# Altium schematic sheet Принципиальная схема 436122_001.SchDoc
size 209 x 297 mm; CompanyName: MOSTЫ; SheetNumber: 1; SheetTotal: 1; PageSetup: Record=PageOptions|CenterHorizontal=True|CenterVertical=True|PrintScale=0.94|XCorrection=1.00|YCorrection=1.00|PrintKind=1|BorderSize=5000000|LeftOffset=0|BottomOffset=0|Orientation=1|PaperLength=1000|PaperWidth=1000|Scale=100|PaperSource=7|PrintQuality=-4|MediaType=1|DitherType=10|PaperKind=A4|PrintScaleMode=1; DecimalNumber: XXXX.426122.001; Name1: Плата распределния; lit_A: О; Name2: питания
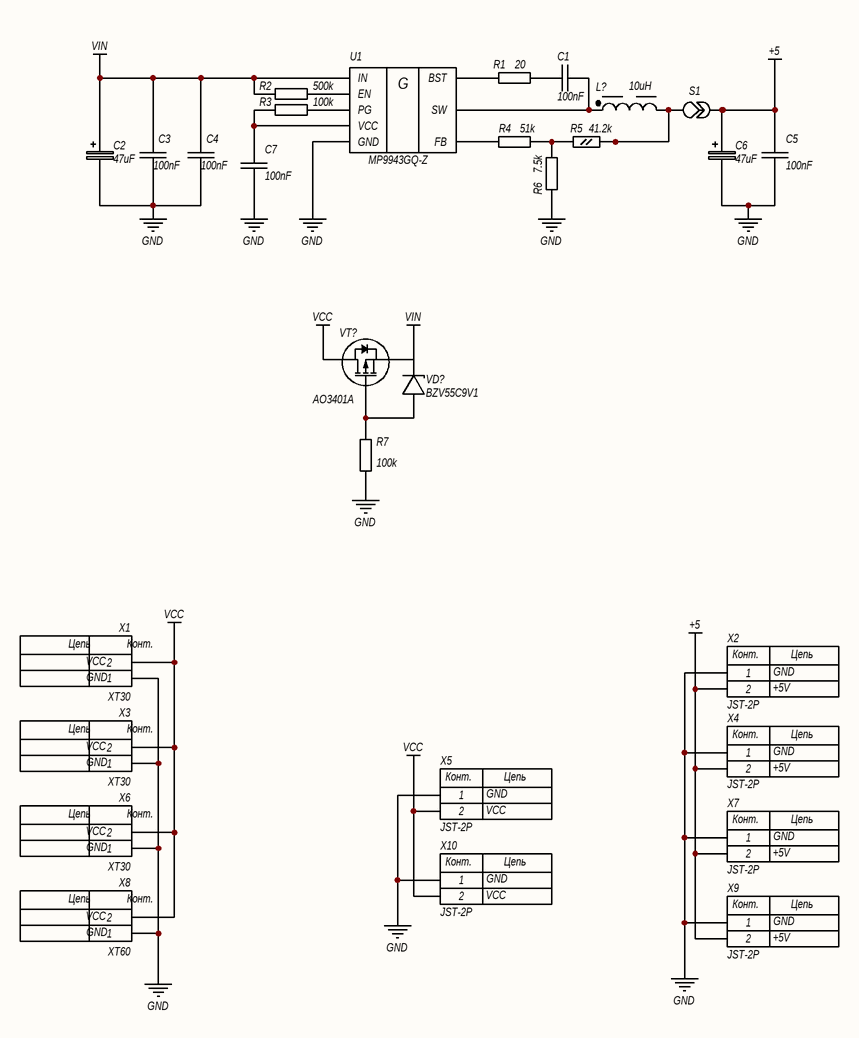
[diagram p0: Принципиальная схема 436122_001.SchDoc]

## Parts
C1  100nF  [CAPC2012X10N]
C2  47uF  [FP-TPSD-MFG]
C3  100nF  [CAPC2012X10N]
C4  100nF  [CAPC2012X10N]
C5  100nF  [CAPC2012X10N]
C6  47uF  [FP-TPSD-MFG]
C7  100nF  [CAPC2012X10N]
L?  10uH  [WE-TPC_4828]
R1  20  [RES0805]
R2  500k  [RES0805]
R3  100k  [RES0805]
R4  51k  [RES0805]
R5  41.2k  [МЛТ-0.125]
R6  7.5k  [RES0805]
R7  100k  [RES0805]
S1  (no value)  [Solder bridge]
U1  MP9943GQ-Z  [MP9943 QFN8]
VD?  BZV55C9V1  [FP-DO-213AA-MFG]
VT?  AO3401A  [SOT-23]
X1  XT30  [XT30PWM]
X2  JST-2P  [FP-B2B-XH-AM_LF_SN-MFG]
X3  XT30  [XT30PWM]
X4  JST-2P  [FP-S2B-XH-A-1_LF_SN-MFG]
X5  JST-2P  [FP-S2B-XH-A-1_LF_SN-MFG]
X6  XT30  [XT30PWM]
X7  JST-2P  [FP-S2B-XH-A-1_LF_SN-MFG]
X8  XT60  [XT60-perpendicular]
X9  JST-2P  [FP-S2B-XH-A-1_LF_SN-MFG]
X10  JST-2P  [FP-S2B-XH-A-1_LF_SN-MFG]

## Nets
+5: C5.1(+) C6.2(-) S1.2 X2.2 X4.2 X7.2 X9.2
GND: C2.1(+) C3.2(-) C4.2(-) C5.2(-) C6.1(+) C7.2(-) R6.1 R7.1 U1.5(GND) X1.1 X2.1 X3.1 X4.1 X5.1 X6.1 X7.1 X8.1 X9.1 X10.1
VCC: VT?.3(DRAIN) X1.2 X3.2 X5.2 X6.2 X8.2 X10.2
VIN: C2.2(-) C3.1(+) C4.1(+) R2.1 U1.7(IN) VD?.1 VT?.2(SOURCE)
NetC1_1: C1.1(+) L?.1 U1.6(SW)
NetC1_2: C1.2(-) R1.2
NetC7_1: C7.1(+) R3.1 U1.2(VCC)
NetL?_2: L?.2 R5.2 S1.1
NetR1_1: R1.1 U1.4(BST)
NetR2_2: R2.2 U1.3(EN)
NetR3_2: R3.2 U1.8(PG)
NetR4_1: R4.1 U1.1(FB)
NetR4_2: R4.2 R5.1 R6.2
NetR7_2: R7.2 VD?.2 VT?.1(GATE)

## Notes on the sheet
- Перв.примен.
- Справ.№
- Подп. и дата
- Инв.№ дубл.
- Взам.инв.№
- Подп.и дата
- Разраб.
- Изм.
- Лист
- № докум.
- Подп.
- Дата
- Лит.
- Масштаб
- Масса
- Т.контр.
- Пров.
- СХЕМА   ЭЛЕКТРИЧЕСКАЯ
- ПРИНЦИПИАЛЬНАЯ
- Листов
- Инв.№ подл.
- Утв.
- Н.контр.
- Нач.сект.
- (in symbol JST-2P) Конт.; Цепь
- (in symbol MP9943GQ-Z) G
- (in symbol XT30) Цепь; Конт.; VCC
- (in symbol XT60) Цепь; Конт.; VCC

## Library data of the parts
C1 C3-C5 C7 = Конденсатор керамика: ClassName: DCDC
C2 C6 = Конденсатор танталовый: Capacitor Polarised; Manufacturer_Name: Vishay; Manufacturer_Part_Number: 293D475X9010A2TE3; Datasheet Link: http://www.vishay.com/docs/40002/293d.pdf; Height: 1.8mm; Mouser Part Number: 74-293D475X9010A2TE3; Mouser Price/Stock: https://www.mouser.co.uk/ProductDetail/Vishay-Sprague/293D475X9010A2TE3?qs=zj6zwI%252Bv92RDYyeabgx%252B6w%3D%3D; Arrow Part Number: 293D475X9010A2TE3; Arrow Price/Stock: https://www.arrow.com/en/products/293d475x9010a2te3/vishay; ClassName: DCDC
L? = Дроссель: NexarPartId: 22866852; RMS Current (Irms): 420mA; Shielding: Shielded; Inductance: 150µH; Self Resonant Frequency: 7MHz; Saturation Current: 220mA; Core Material: Ferrite; Inductance Tolerance: 30%; DC Resistance (DCR): 770mΩ; Test Frequency: 100kHz; Max Operating Temperature: 125°C; Case/Package: 1919; Height - Seated (Max): 2.9972mm; Packaging: Tape & Reel (TR); Case Code (Imperial): 1919; Min Operating Temperature: -40°C; Current Rating: 420mA; Width: 4.8mm; Ambient Temperature Range High: 95°C; Ambient Temperature Range Low: -40°C; Mount: Surface Mount; Composition: Wirewound; Number of Pins: 2; REACH SVHC: Unknown; RoHS: Compliant; Case Code (Metric): 4848; Tolerance: 30%; Height: 2.8mm; Length: 4.8mm; Max DC Current: 420mA; Termination: SMD/SMT
R1-R4 R6 R7 = Резистор SMD: SMD resistors with differents footprints; ClassName: BootLogic
R5 = МЛТ-0.125: ClassName: DCDC
S1 = Запаиваемая перемычка: Нормально замкнута
U1 = MP9943GQ-Z: High Efficiency 3A Peak, 36V, / Synchronous Step Down Converter / With Power Good; ClassName: DCDC
VD? = Стабилитрон
VT? = P-MOS: P-Channel MOSFET; Manufacturer: Alpha and Omega; Output Power (Max): NotRequiredW; Power Dissipation: 1.4W; Rad Hardened: No; Drain Efficiency: NotRequired%; Drain-Source On-Volt: 30V; Noise Figure: NotRequireddB; Frequency (Max): NotRequiredMHz; Number of  Elements: 1; Gate-Source Voltage (Max): ?12V; Drain Current (Max): 4A; Channel Mode: Enhancement; Drain-Source On-Res: 0.044ohm; Type: PowerMOSFET; Polarity: P; Package URL: http://www.aosmd.com/res/packaging_information/SOT-23-3L.pdf; Datasheet URL: http://www.aosmd.com/res/data_sheets/AO3401A.pdf; Package Type: SOT-23; Package Description: 3-Pin Small Outline Transistor, Body 2.95 x 1.6 mm, Pitch 0.95 mm; Mounting: SurfaceMount; Manufacturer URL: http://www.aosmd.com/; Continuous Drain Current: 4A; Package Reference: SOT-23-3L; Mounting Technology: SurfaceMount; Operating Temperature Classification: Military; Power Gain: NotRequireddB; Datasheet Version: Rev. 3, 03/2011; Operating Temp Range: -55Cto150C; Pin Count: 3
X1 X3 X6 = XT30: XT30-PWM; Net1: GND; Net2: +5V; Net3: RX; Net4: TX
X2 X4 X7 X9 = JST-2P: JST type connector; Net1: GND; Net2: +5V
X5 X10 = JST-2P: JST type connector; Net1: GND; Net2: VCC
X8 = XT60: XT60 perpendicular connector; Net1: GND; Net2: +5V; Net3: RX; Net4: TX